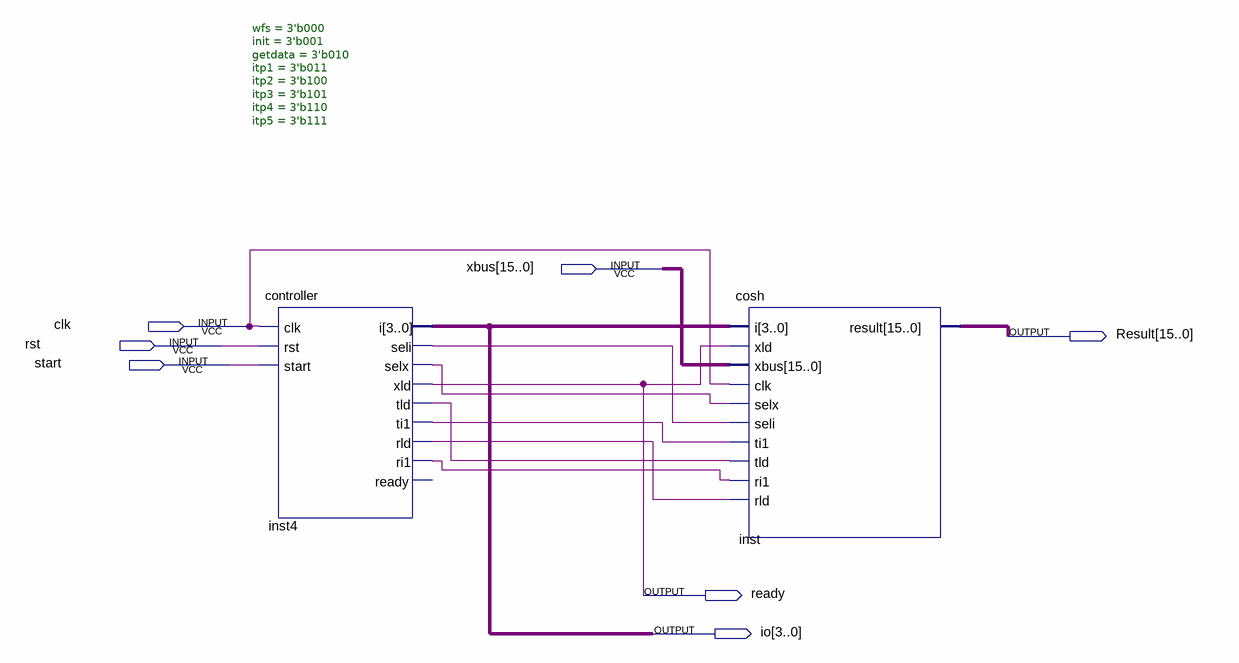
[diagram p0: schematic sheet]
// Quartus schematic coshblock.bdf as structural Verilog: 2 symbols, 7 pins
module coshblock (
  input  [15:0] xbus,
  input  clk,
  input  rst,
  input  start,
  output [15:0] Result,
  output ready,
  output [3:0] io
);

  wire inst4_ri1, inst4_rld, inst4_seli, inst4_selx, inst4_ti1, inst4_tld;

  controller #(.wfs(3'b000), .init(3'b001), .getdata(3'b010), .itp1(3'b011), .itp2(3'b100), .itp3(3'b101), .itp4(3'b110), .itp5(3'b111)) inst4 (
    .clk(clk), .rst(rst), .start(start), .i(io), .seli(inst4_seli), .selx(inst4_selx), .xld(ready),
    .tld(inst4_tld), .ti1(inst4_ti1), .rld(inst4_rld), .ri1(inst4_ri1));  // open: ready
  cosh inst (
    .i(io), .xld(ready), .xbus(xbus), .clk(clk), .selx(inst4_selx), .seli(inst4_seli), .ti1(inst4_ti1),
    .tld(inst4_tld), .ri1(inst4_ri1), .rld(inst4_rld), .result(Result));
endmodule
